# Altium schematic sheet Power.SchDoc
size B
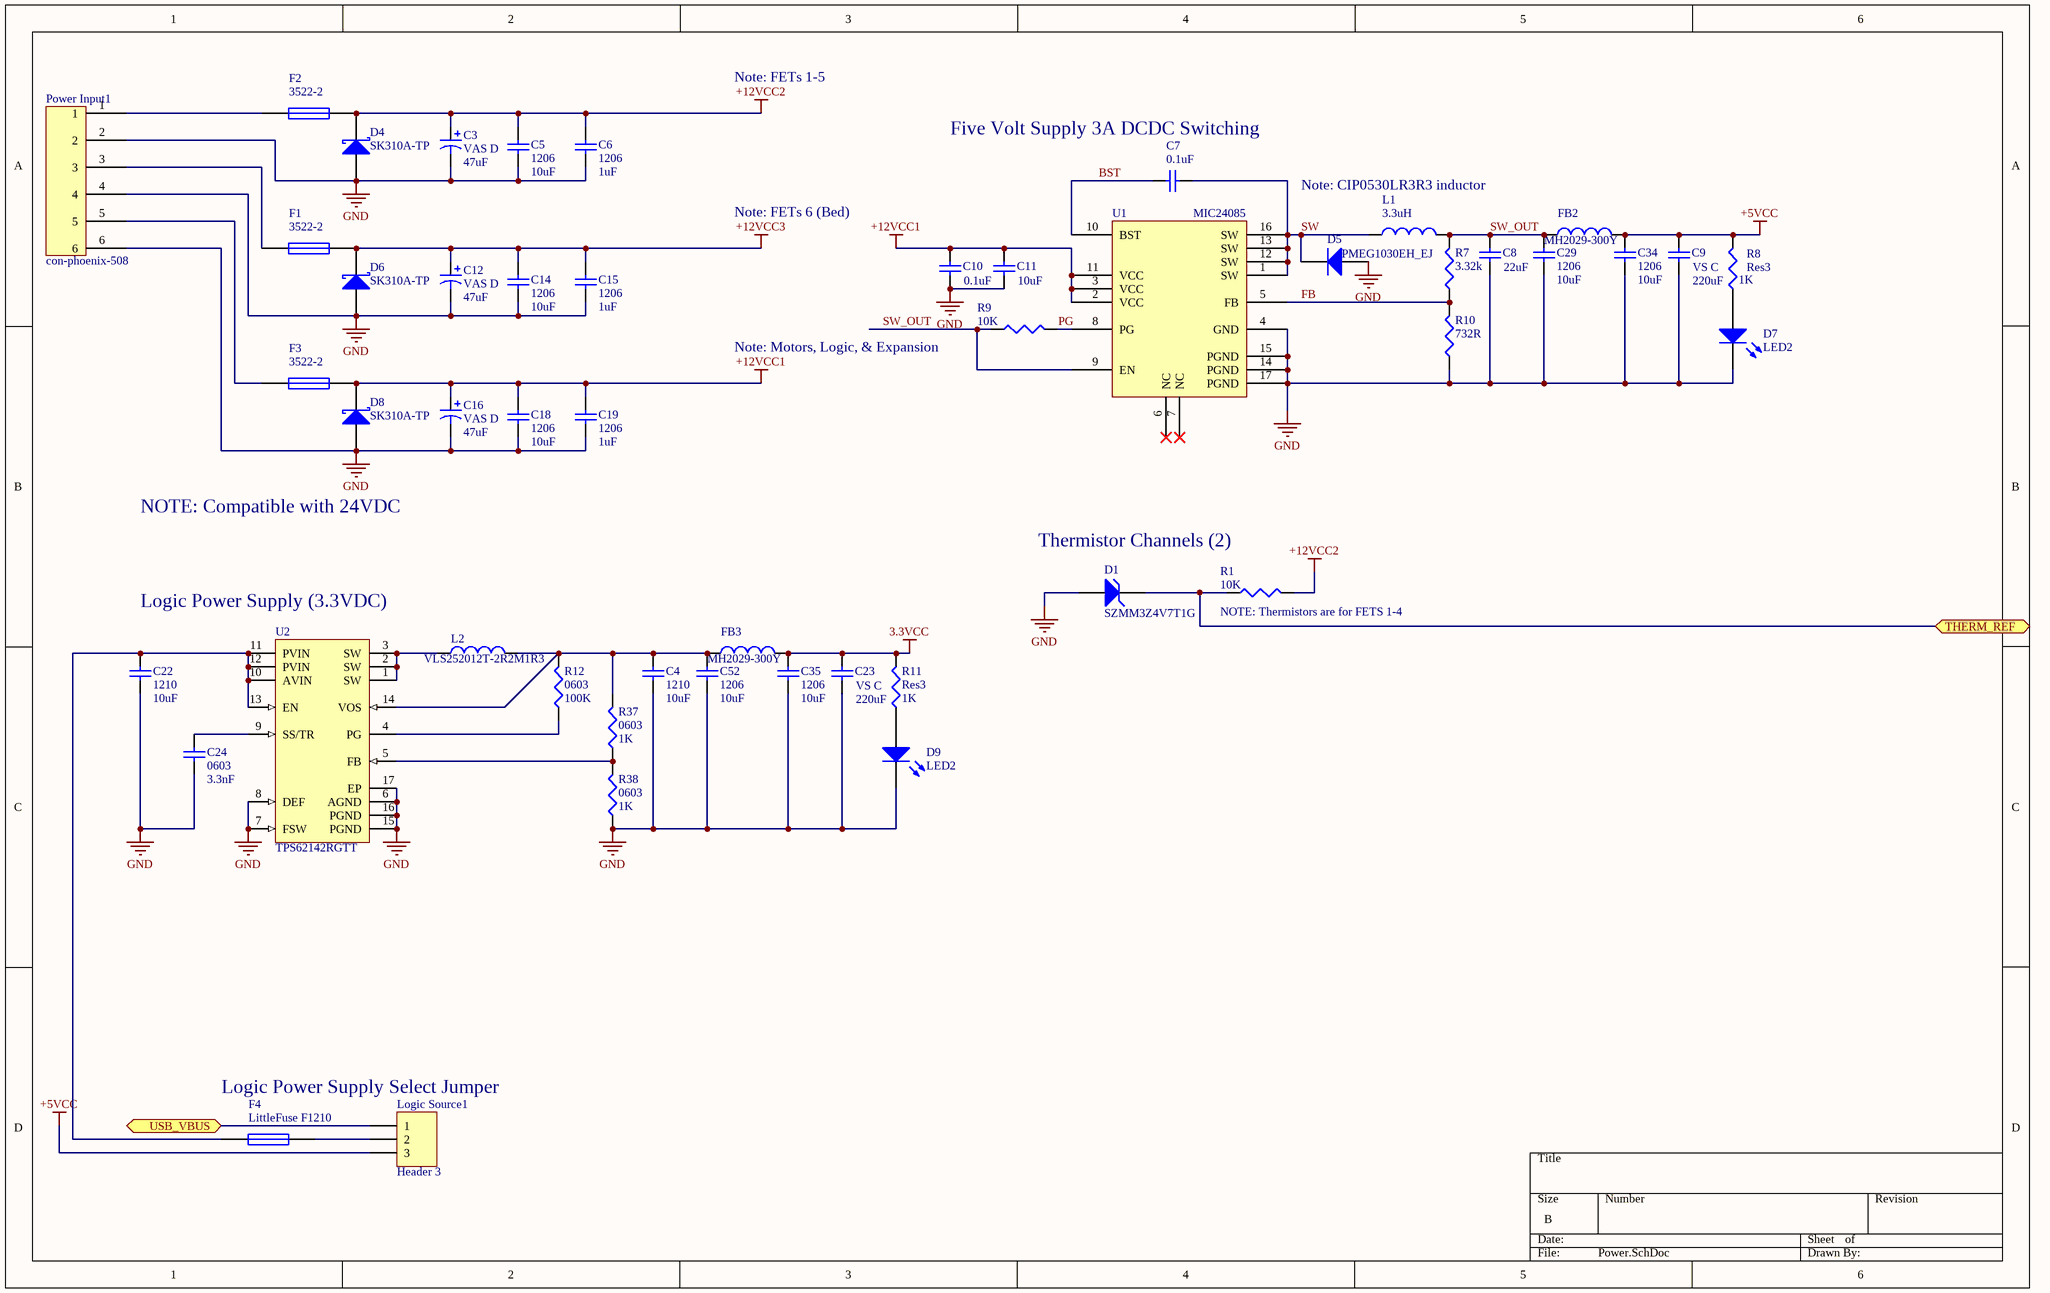
[diagram p0: Power.SchDoc]

## Parts
C3  VAS D  value 47uF  [Panasonic VS D]
C4  1210  value 10uF  [C1210]
C5  1206  value 10uF  [C1206]
C6  1206  value 1uF  [C1206]
C7  value 0.1uF  [1608[0603]]  (hidden comment: Cap Semi)
C8  value 22uF  [C1206]  (hidden comment: Cap Semi)
C9  VS C  value 220uF  [Panasonic VS C]
C10  value 0.1uF  [C1206]  (hidden comment: Cap Semi)
C11  value 10uF  [1608[0603]]  (hidden comment: Cap Semi)
C12  VAS D  value 47uF  [Panasonic VS D]
C14  1206  value 10uF  [C1206]
C15  1206  value 1uF  [C1206]
C16  VAS D  value 47uF  [Panasonic VS D]
C18  1206  value 10uF  [C1206]
C19  1206  value 1uF  [C1206]
C22  1210  value 10uF  [C1210]
C23  VS C  value 220uF  [Panasonic VS C]
C24  0603  value 3.3nF  [1608[0603]]
C29  1206  value 10uF  [C1206]
C34  1206  value 10uF  [C1206]
C35  1206  value 10uF  [C1206]
C52  1206  value 10uF  [C1206]
D1  SZMM3Z4V7T1G  [SZMM3Z4V7T1G]
D4  SK310A-TP  [SK310A-TP]
D5  PMEG1030EH_EJ  [PMEG1030EH_EJ]
D6  SK310A-TP  [SK310A-TP]
D7  LED2  [SM 0805 polarized]
D8  SK310A-TP  [SK310A-TP]
D9  LED2  [SM 0805 polarized]
F1  3522-2  [3522-2]
F2  3522-2  [3522-2]
F3  3522-2  [3522-2]
F4  LittleFuse F1210  [F1210_M]
FB2  MH2029-300Y  [SM 0805 - gap trimmed]
FB3  MH2029-300Y  [SM 0805 - gap trimmed]
L1  value 3.3uH  [CIP0530LR3R3]  (hidden comment: Inductor)
L2  VLS252012T-2R2M1R3  [VLS252012T-2R2M1R3]
Logic_Source1  Header 3  [HDR1X3]
Power_Input1  con-phoenix-508  [MSTBV6]
R1  value 10K  [J1-0603]  (hidden comment: Res3)
R7  value 3.32k  [J1-0603]  (hidden comment: Res3)
R8  Res3  value 1K  [SM 0805 - gap trimmed]
R9  value 10K  [J1-0603]  (hidden comment: Res3)
R10  value 732R  [J1-0603]  (hidden comment: Res3)
R11  Res3  value 1K  [SM 0805 - gap trimmed]
R12  0603  value 100K  [J1-0603]
R37  0603  value 1K  [J1-0603]
R38  0603  value 1K  [J1-0603]
U1  MIC24085  [MIC24085-AYML]
U2  TPS62142RGTT  [RGT16-1700X1700TP]

## Ports
THERM_REF, USB_VBUS (bidir)

## Nets
3.3VCC: C23.1 C35.1 FB3.2 R11.2
+5VCC: C9.1 C34.1 FB2.2 Logic_Source1.3 R8.2
+12VCC1: C10.2 C11.2 C16.1 C18.2 C19.2 D8.2(K) F3.2 U1.2(VCC) U1.3(VCC) U1.11(VCC)
+12VCC2: C3.1 C5.2 C6.2 D4.2(K) F2.2 R1.2
+12VCC3: C12.1 C14.2 C15.2 D6.2(K) F1.2
GND: C3.2 C4.2 C5.1 C6.1 C8.1 C9.2 C10.1 C11.1 C12.2 C14.1 C15.1 C16.2 C18.1 C19.1 C22.2 C23.2 C24.1 C29.2 C34.2 C35.2 C52.2 D1.1(A) D4.1(A) D5.1(A) D6.1(A) D7.1(A) D8.1(A) D9.1(A) Power_Input1.2 Power_Input1.4 Power_Input1.6 R10.1 R38.1 U1.4(GND) U1.14(PGND) U1.15(PGND) U1.17(PGND) U2.6(AGND) U2.7(FSW) U2.8(DEF) U2.15(PGND) U2.16(PGND) U2.17(EP)
BST: C7.2 U1.10(BST)
FB: R7.1 R10.2 U1.5(FB)
PG: R9.2 U1.8(PG)
SW: C7.1 D5.2(K) L1.1 U1.1(SW) U1.12(SW) U1.13(SW) U1.16(SW)
SW_OUT: C8.2 C29.1 FB2.1 L1.2 R7.2 R9.1 U1.9(EN)
THERM_REF: D1.2(K) R1.1 ; port THERM_REF
USB_VBUS: Logic_Source1.1 ; port USB_VBUS
NetC4_1: C4.1 C52.1 FB3.1 L2.2 R12.2 R37.2 U2.14(VOS)
NetC22_1: C22.1 F4.1 U2.10(AVIN) U2.11(PVIN) U2.12(PVIN) U2.13(EN)
NetC24_2: C24.2 U2.9(SS/TR)
NetD7_2: D7.2(K) R8.1
NetD9_2: D9.2(K) R11.1
NetF1_1: F1.1 Power_Input1.3
NetF2_1: F2.1 Power_Input1.1
NetF3_1: F3.1 Power_Input1.5
NetF4_2: F4.2 Logic_Source1.2
NetL2_1: L2.1 U2.1(SW) U2.2(SW) U2.3(SW)
NetR12_1: R12.1 U2.4(PG)
NetR37_1: R37.1 R38.2 U2.5(FB)

Not connected (* = marked no-connect by the designer): U1 6(NC)* 7(NC)*

## Notes on the sheet
- Note: FETs 1-5
- (near C7) Five Volt Supply 3A DCDC Switching
- Note: FETs 6 (Bed)
- Note: CIP0530LR3R3 inductor
- (near R9) Note: Motors, Logic, & Expansion
- NOTE: Compatible with 24VDC
- Thermistor Channels (2)
- Logic Power Supply (3.3VDC)
- (near R1) NOTE: Thermistors are for FETS 1-4
- Logic Power Supply Select Jumper

## Library data of the parts
C3 C12 C16 = Cap Pol1: Polarized Capacitor (Radial); Published: 8-Jun-2000; LatestRevisionDate: 17-Jul-2002; LatestRevisionNote: Re-released for DXP Platform.; PackageReference: RB7.6-15; Publisher: Altium Limited; PackageDescription: Polarized Capacitor (Radial); 2 Leads
C4-C11 C14 C15 C18 C19 C22-C24 C29 C34 C35 C52 = Cap Semi: Capacitor (Semiconductor SIM Model); Published: 8-Jun-2000; LatestRevisionDate: 29-May-2009; LatestRevisionNote: IPC-7351 Footprint Added.; PackageReference: C1206; Publisher: Altium Limited; PackageDescription: Chip Capacitor
D1 = D Zener: Zener Diode; Published: 8-Jun-2000; LatestRevisionDate: 17-Jul-2002; LatestRevisionNote: Re-released for DXP Platform.; PackageReference: DIODE-0.7; Publisher: Altium Limited; PackageDescription: Diode, Thru-Hole; 2 Leads; 0.7 in Pin Spacing
D4 D6 D8 = D Schottky: Schottky Diode; Published: 8-Jun-2000; LatestRevisionDate: 17-Jul-2002; LatestRevisionNote: Re-released for DXP Platform.; PackageReference: SMB; Publisher: Altium Limited; PackageDescription: DO-214-AA/SMB; 2 C-Bend Leads; Body 5.3 x 3.6 mm, inc. leads (LxW); Code_JEDEC: DO-214-AA
D5 = PMEG1030EH_EJ: Default Diode; Published: 8-Jun-2000; LatestRevisionDate: 17-Jul-2002; LatestRevisionNote: Re-released for DXP Platform.; PackageVersion: Sep-1996; PackageReference: SMC; Publisher: Altium Limited; PackageDescription: DO-214-AB/SMC; 2 C-Bend Leads; Body 7.9 x 5.9 mm, inc. leads (LxW); Code_JEDEC: DO-214-AB
D7 D9 = LED2: Typical RED, GREEN, YELLOW, AMBER GaAs LED; Published: 8-Jun-2000; LatestRevisionDate: 17-Jul-2002; LatestRevisionNote: Re-released for DXP Platform.; PackageVersion: Feb-2002; PackageReference: 3.2X1.6X1.1; Publisher: Altium Limited; PackageDescription: SM LED; 2 Flat Leads
F1-F4 = Fuse 1: Fuse; Published: 8-Jun-2000; LatestRevisionDate: 17-Jul-2002; LatestRevisionNote: Re-released for DXP Platform.; PackageReference: PIN-W2/E2.8; Publisher: Altium Limited; PackageDescription: Thru-Hole; 2 Leads
FB2 FB3 L1 L2 = Inductor: Code_IEC: 1005; Published: 8-Jun-2000; PackageReference: 0402-A; Publisher: Altium Limited; Code_JEITA: 0402
  FB2 FB3 L2: LatestRevisionDate: 17-Jul-2002; LatestRevisionNote: Re-released for DXP Platform.
  L1: LatestRevisionDate: 29-May-2009; LatestRevisionNote: IPC-7351 Footprint Added.; PackageDescription: Chip Inductor
Logic_Source1 = Header 3: Header, 3-Pin; LatestRevisionDate: 17-Jul-2002; LatestRevisionNote: Re-released for DXP Platform.; Publisher: Altium Limited
R1 R7-R12 R37 R38 = Res3: Resistor; Published: 8-Jun-2000; LatestRevisionDate: 29-May-2009; LatestRevisionNote: IPC-7351 Footprint Added.; PackageReference: J1-0603; Publisher: Altium Limited; PackageDescription: Chip Resistor
U2 = TPS62142RGTT: Buck Step Down Regulator with 3 to 17 V Input and 3.3 V Output, -40 to 85 degC, 16-Pin QFN (RGT), Green (RoHS & no Sb/Br); Manufacturer: Texas Instruments; Duty Cycle(Max)(%): 100; Iout(Max)(A): 2; Iq(Typ)(mA): 0.017; Preset Vout(V): 3.3; Rating: Catalog; Regulated Outputs(#): 1; SubFamily: Step-Down Regulator; Switch Current Limit(Typ)(A): 3; Synchronous Rectification: TRUE; Vin(Max)(V): 17; DatasheetVersion: SLVSAJ0; PackageVersion: revH, Oct-2011; PackageReference: RGT16-1700X1700TP; PackageDescription: 16-Pin Plastic Quad Flat No-Lead, 3 x 3 mm Body, 0.5 mm Pitch, 1.7 x 1.7 mm Exposed Pad; Supplier 1: Digi-Key; Supplier Part Number 1: 296-29940-2-ND; Supplier 2: Digi-Key; Supplier Part Number 2: 296-29940-1-ND; Supplier 3: Digi-Key; Supplier Part Number 3: 296-29940-6-ND; Supplier 4: Newark; Supplier Part Number 4: 74T5540; Supplier 5: Mouser; Supplier Part Number 5: 595-TPS62142RGTT; Eco-Plan: Green (RoHS & no Sb/Br); Topology: Buck; Vin(Min)(V): 3; Vout(Max)(V): 3.3; Vout(Min)(V): 3.3; Mounting Technology: Surface Mount; Code_JEDEC: MO-220; PartNumber: TPS62142RGTT; ComponentLink1Description: Datasheet; ComponentLink1URL: http://www.ti.com/general/docs/lit/getliterature.tsp?genericPartNumber=TPS62142&fileType=pdf; ComponentLink2Description: Package Specification; ComponentLink2URL: http://www.ti.com/litv/pdf/mpqf119g; ComponentLink3Description: URL Link1; ComponentLink3URL: Samples URL:http://www.ti.com/product/tps54611#samples